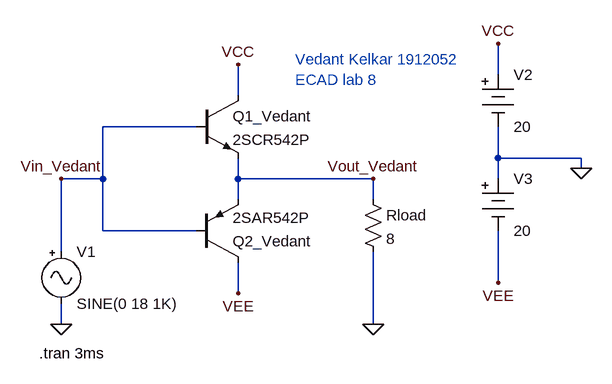
[diagram p0: schematic ECAD_Lab8.asc]
ECAD_Lab8.asc, the LTspice schematic file:
Version 4
SHEET 1 880 680
WIRE 608 32 608 -16
WIRE 208 64 208 16
WIRE 144 112 0 112
WIRE 608 160 608 112
WIRE 736 160 608 160
WIRE 736 176 736 160
WIRE 0 192 0 112
WIRE 0 192 -64 192
WIRE 208 192 208 160
WIRE 416 192 208 192
WIRE 608 192 608 160
WIRE 208 224 208 192
WIRE 416 224 416 192
WIRE 0 272 0 192
WIRE 144 272 0 272
WIRE -64 304 -64 192
WIRE 608 352 608 272
WIRE 208 368 208 320
WIRE -64 416 -64 384
WIRE 416 416 416 304
FLAG 416 416 0
FLAG -64 416 0
FLAG 608 -16 VCC
FLAG 208 16 VCC
FLAG 608 352 VEE
FLAG 208 368 VEE
FLAG 736 176 0
FLAG 416 192 Vout_Vedant
FLAG -64 192 Vin_Vedant
SYMBOL npn 144 64 R0
SYMATTR InstName Q1_Vedant
SYMATTR Value 2SCR542P
SYMBOL pnp 144 320 M180
SYMATTR InstName Q2_Vedant
SYMATTR Value 2SAR542P
SYMBOL res 400 208 R0
SYMATTR InstName Rload
SYMATTR Value 8
SYMBOL Misc\\signal -64 288 R0
SYMATTR InstName V1
SYMATTR Value SINE(0 18 1K)
SYMBOL Misc\\battery 608 16 R0
SYMATTR InstName V2
SYMATTR Value 20
SYMBOL Misc\\battery 608 176 R0
SYMATTR InstName V3
SYMATTR Value 20
TEXT -98 460 Left 2 !.tran 3ms
TEXT 296 8 Left 2 ;Vedant Kelkar 1912052\nECAD lab 8

The netlist it stands for:
* ECAD_Lab8.asc
Q1_Vedant VCC Vin_Vedant Vout_Vedant 0 2SCR542P
Q2_Vedant VEE Vin_Vedant Vout_Vedant 0 2SAR542P
Rload Vout_Vedant 0 8
V1 Vin_Vedant 0 SINE(0 18 1K)
V2 VCC 0 20
V3 0 VEE 20
.model NPN NPN
.model PNP PNP
.lib standard.bjt
.tran 3ms
* Vedant Kelkar 1912052
* ECAD lab 8
.backanno
.end